# Altium schematic sheet mainPower.SchDoc
size A3; SheetNumber: 1; SheetTotal: 2
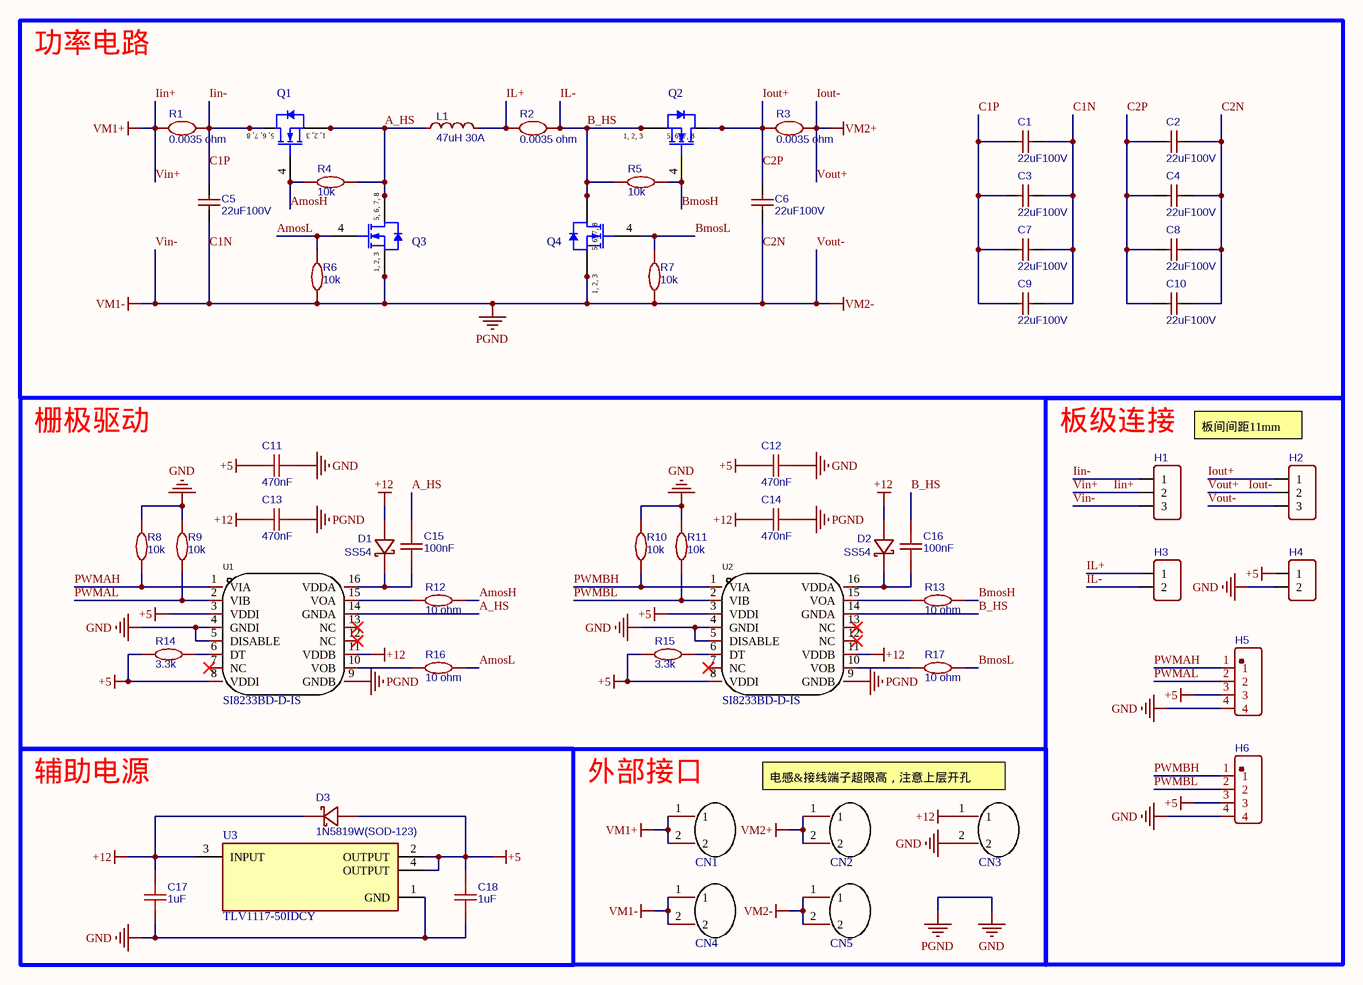
[diagram p0: mainPower.SchDoc]

## Parts
C1  22uF100V  [C1206]
C2  22uF100V  [C1206]
C3  22uF100V  [C1206]
C4  22uF100V  [C1206]
C5  22uF100V  [C1206]
C6  22uF100V  [C1206]
C7  22uF100V  [C1206]
C8  22uF100V  [C1206]
C9  22uF100V  [C1206]
C10  22uF100V  [C1206]
C11  470nF  [C0603]
C12  470nF  [C0603]
C13  470nF  [C0603]
C14  470nF  [C0603]
C15  100nF  [C0603]
C16  100nF  [C0603]
C17  1uF  [C0603]
C18  1uF  [C0603]
CN1  1729128  [CONN-TH_2P-P5.08]  (value not drawn)
CN2  1729128  [CONN-TH_2P-P5.08]  (value not drawn)
CN3  1729128  [CONN-TH_2P-P5.08]  (value not drawn)
CN4  1729128  [CONN-TH_2P-P5.08]  (value not drawn)
CN5  1729128  [CONN-TH_2P-P5.08]  (value not drawn)
D1  SS54  [SMA]
D2  SS54  [SMA]
D3  1N5819W(SOD-123)  [SOD-123]
H1  Header-Male-2.54_1x3  [HDR2.54-LI-3P]  (value not drawn)
H2  Header-Male-2.54_1x3  [HDR2.54-LI-3P]  (value not drawn)
H3  Header-Male-2.54_1x2  [HDR2.54-LI-2P]  (value not drawn)
H4  Header-Male-2.54_1x2  [HDR2.54-LI-2P]  (value not drawn)
H5  Header-Male-2.54_1x4  [HDR2.54-LI-4P]  (value not drawn)
H6  Header-Male-2.54_1x4  [HDR2.54-LI-4P]  (value not drawn)
L1  47uH 30A  [106-125立式]
Q1  BSC070N10NS3 G  [INF-PG-TDSON-8-1_V]  (value not drawn)
Q2  BSC070N10NS3 G  [INF-PG-TDSON-8-1_V]  (value not drawn)
Q3  BSC070N10NS3 G  [INF-PG-TDSON-8-1_V]  (value not drawn)
Q4  BSC070N10NS3 G  [INF-PG-TDSON-8-1_V]  (value not drawn)
R1  0.0035 ohm  [R2512]
R2  0.0035 ohm  [R2512]
R3  0.0035 ohm  [R2512]
R4  10k  [R0603]
R5  10k  [R0603]
R6  10k  [R0603]
R7  10k  [R0603]
R8  10k  [R0603]
R9  10k  [R0603]
R10  10k  [R0603]
R11  10k  [R0603]
R12  10 ohm  [R0603]
R13  10 ohm  [R0603]
R14  3.3k  [R0603]
R15  3.3k  [R0603]
R16  10 ohm  [R0603]
R17  10 ohm  [R0603]
U1  SI8233BD-D-IS  [SOIC-16_L10.3-W7.5-P1.27-LS10.3-BL]
U2  SI8233BD-D-IS  [SOIC-16_L10.3-W7.5-P1.27-LS10.3-BL]
U3  TLV1117-50IDCY  [FP-DCY0004A-MFG]

## Blocks framed on the sheet
功率电路: C1-C10 L1 Q1-Q4 R1-R7
栅极驱动: C11-C16 D1 D2 R8-R17 U1 U2
板级连接: H1-H6
辅助电源: C17 C18 D3 U3
外部接口: CN1-CN5

## Nets
+5: C11.2 C12.2 C18.2 D3.1(A) H4.1 H5.3 H6.3 R14.1 R15.1 U1.3(VDDI) U1.8(VDDI) U2.3(VDDI) U2.8(VDDI) U3.2(OUTPUT) U3.4(OUTPUT)
+12: C13.2 C14.2 C17.2 CN3.1 D1.1(A) D2.1(A) D3.2(K) U1.11(VDDB) U2.11(VDDB) U3.3(INPUT)
C1N: C1.2 C2.2 C3.2 C4.2 C5.1 C6.1 C7.2 C8.2 C9.2 C10.2 C11.1 C12.1 C13.1 C14.1 C17.1 C18.1 CN3.2 CN4.1 CN4.2 CN5.1 CN5.2 H1.3 H2.3 H4.2 H5.4 H6.4 Q3.1(SOURCE) Q3.2(SOURCE) Q3.3(SOURCE) Q4.1(SOURCE) Q4.2(SOURCE) Q4.3(SOURCE) R6.1 R7.1 R8.2 R9.2 R10.2 R11.2 U1.4(GNDI) U1.5(DISABLE) U1.9(GNDB) U2.4(GNDI) U2.5(DISABLE) U2.9(GNDB) U3.1(GND)  [also labelled C2N, GND, PGND, Vin-, VM1-, VM2-, Vout-]
Iin+: CN1.1 CN1.2 H1.2 R1.1  [also labelled Vin+, VM1+]
Iout-: CN2.1 CN2.2 H2.2 R3.2  [also labelled VM2+, Vout+]
A_HS: C15.2 L1.1 Q1.1(SOURCE) Q1.2(SOURCE) Q1.3(SOURCE) Q3.5(DRAIN) Q3.6(DRAIN) Q3.7(DRAIN) Q3.8(DRAIN) R4.1 U1.14(GNDA)
AmosH: Q1.4(GATE) R4.2 R12.2
AmosL: Q3.4(GATE) R6.2 R16.2
B_HS: C16.2 H3.2 Q2.1(SOURCE) Q2.2(SOURCE) Q2.3(SOURCE) Q4.5(DRAIN) Q4.6(DRAIN) Q4.7(DRAIN) Q4.8(DRAIN) R2.2 R5.2 U2.14(GNDA)  [also labelled IL-]
BmosH: Q2.4(GATE) R5.1 R13.2
BmosL: Q4.4(GATE) R7.2 R17.2
C1P: C1.1 C3.1 C5.2 C7.1 C9.1 H1.1 Q1.5(DRAIN) Q1.6(DRAIN) Q1.7(DRAIN) Q1.8(DRAIN) R1.2  [also labelled Iin-]
C2P: C2.1 C4.1 C6.2 C8.1 C10.1 H2.1 Q2.5(DRAIN) Q2.6(DRAIN) Q2.7(DRAIN) Q2.8(DRAIN) R3.1  [also labelled Iout+]
IL+: H3.1 L1.2 R2.1
PWMAH: H5.1 R8.1 U1.1(VIA)
PWMAL: H5.2 R9.1 U1.2(VIB)
PWMBH: H6.1 R10.1 U2.1(VIA)
PWMBL: H6.2 R11.1 U2.2(VIB)
NetC15_1: C15.1 D1.2(K) U1.16(VDDA)
NetC16_1: C16.1 D2.2(K) U2.16(VDDA)
NetR12_1: R12.1 U1.15(VOA)
NetR13_1: R13.1 U2.15(VOA)
NetR14_2: R14.2 U1.6(DT)
NetR15_2: R15.2 U2.6(DT)
NetR16_1: R16.1 U1.10(VOB)
NetR17_1: R17.1 U2.10(VOB)

Not connected (* = marked no-connect by the designer): U1 7(NC)* 12(NC)* 13(NC)*; U2 7(NC)* 12(NC)* 13(NC)*

## Notes on the sheet
- 板间间距11mm
- 电感&接线端子超限高，注意上层开孔
- (in symbol BSC070N10NS3G) 5, 6, 7, 8; 1, 2, 3

## Library data of the parts
C1-C10 = C1206: BOM_Manufacturer: FH; BOM_Manufacturer Part: 1206B102K202NT; nameAlias: Capacitance; BOM_Supplier: LCSC; BOM_Supplier Part: C9196; BOM_JLCPCB Part Class: Basic Part; spicePre: C; spiceSymbolName: 1206B102K202NT
C11-C18 = C0603: BOM_Manufacturer: YAGEO; BOM_Manufacturer Part: CC0603KRX7R9BB104; nameAlias: Capacitance; BOM_Supplier: LCSC; BOM_Supplier Part: C14663; BOM_JLCPCB Part Class: Basic Part; spicePre: C; spiceSymbolName: CC0603KRX7R9BB104
CN1-CN5 = MKDSN5.08-2P: 间距:5.08mm;排数:1;每排PIN数:2;安装方式:直针;额定电流:13.5A;额定电压:400V;工作温度范围:-;颜色:绿色;; Manufacturer: Phoenix Contact(菲尼克斯); Symbol: MKDSN1.5/2-5.08; Add into BOM: yes; Pitch: 5.08mm; Number of PINs Per Row: 2; Current Rating (Max): 13.5A; Voltage Rating (Max): 400V; Device: 1729128; LCSC Part Name: 5.08mm 排数:1 每排P数:2 直针; Supplier Part: C91153; Manufacturer Part: 1729128; Supplier Footprint: 插件,P=5.08mm; JLCPCB Part Class: Extended Part; Datasheet: https://atta.szlcsc.com/upload/public/pdf/source/20161226/1482720163948.pdf; Supplier: LCSC; Convert to PCB: yes; Number of Rows: 1; Mounting Style: 直针; Operating Temperature Range: -; Color: 绿色
D1 D2 = SS34(SMA): BOM_Manufacturer: Doeshare(德芯); BOM_Manufacturer Part: SS34; Contributor: LCSC; BOM_Supplier: LCSC; BOM_Supplier Part: C2931787; BOM_JLCPCB Part Class: Extended Part; spicePre: D; spiceSymbolName: SS34_C2931787
D3 = 1N5819W(SOD-123): BOM_Manufacturer: Doeshare(德芯); BOM_Manufacturer Part: SS34; Contributor: LCSC; BOM_Supplier: LCSC; BOM_Supplier Part: C2931787; BOM_JLCPCB Part Class: Extended Part; spicePre: D; spiceSymbolName: SS34_C2931787
H1 H2 = Header-Male-2.54_1x3: BOM_Manufacturer: BOOMELE; BOM_Manufacturer Part: Header2.54mm 1*3P; BOM_Supplier: LCSC; BOM_Supplier Part: C49257; BOM_JLCPCB Part Class: Extended Part; spicePre: H; spiceSymbolName: Header-Male-2.54_1x3
H3 H4 = Header-Male-2.54_1x2: BOM_Manufacturer: BOOMELE; BOM_Manufacturer Part: Header2.54mm 1*3P; BOM_Supplier: LCSC; BOM_Supplier Part: C49257; BOM_JLCPCB Part Class: Extended Part; spicePre: H; spiceSymbolName: Header-Male-2.54_1x3
H5 H6 = Header-Male-2.54_1x4: BOM_Manufacturer: Boom Precision Elec; BOM_Manufacturer Part: C247921; Contributor: LCSC; BOM_Supplier: LCSC; BOM_Supplier Part: C247921; BOM_JLCPCB Part Class: Extended Part; spicePre: H; spiceSymbolName: C247921
L1 = 106-125铁硅铝磁环电感: BOM_Manufacturer: FH(风华); BOM_Manufacturer Part: HA42-4R7MT; nameAlias: Inductance; Contributor: LCSC; BOM_Supplier: LCSC; BOM_Supplier Part: C2936653; BOM_JLCPCB Part Class: Extended Part; spicePre: L; spiceSymbolName: HA42-4R7MT
Q1-Q4 = BSC070N10NS3G: N-Channel OptiMOS 3 Power-Transistor, 100 V VDS, 90 A ID, -55 to 150 degC, PG-TDSON-8-1, Reel, Green; Manufacturer: Infineon; QG: 42Â nC; VGS(th) (min): 2Â V; RDS (on) (max): 7Â mOhm; ID (max): 90Â A; Polarity: N; RthJC (max): 1.1Â K/W; RthJA (max): 50Â K/W; VDS (max): 100Â V; Ptot (max): 114Â W; VGS(th) (max): 3.5Â V; IDpuls (max): 360Â A; Green: TRUE; ComponentLink2Description: Datasheet; DatasheetVersion: Rev. 2.0; Mounting Technology: Surface Mount; ComponentLink1Description: Manufacturer URL; ComponentLink3Description: Package Specification; ComponentLink1URL: http://www.infineon.com/; PackageDescription: 8-Pin Plastic (Green) Thin Dual Small Outline Non-Leaded Package, 5.15 x 5.9 mm Body, 1.27 mm Pitch; Packing: Reel; ComponentLink3URL: http://www.infineon.com/cms/packages/SMD_-_Surface_Mounted_Devices/P-PG-TDSON/P-PG-TDSON-08-01x_2x_3.html?__locale=en; PackageReference: PG-TDSON-8-1; PartNumber: BSC070N10NS3 G; Halogen-free: TRUE; Rth: 1.1Â K/W; ComponentLink2URL: http://www.infineon.com/dgdl/BSC070N10NS3+Rev2+1.pdf?folderId=db3a304313b8b5a60113cee8763b02d7&fileId=db3a304327b89750012824712c6c6f2f; Manufacturer Part Number: BSC070N10NS3G
R1-R3 = R2512: BOM_Manufacturer: YAGEO; BOM_Manufacturer Part: SR2512FK-0751RL; nameAlias: Resistance (Ohms); Contributor: LCSC; Resistance: 51Ω; BOM_Supplier: LCSC; BOM_Supplier Part: C375694; BOM_JLCPCB Part Class: Extended Part; spicePre: R; spiceSymbolName: SR2512FK-0751RL
R4-R17 = R0603: BOM_Manufacturer: YAGEO; BOM_Manufacturer Part: SR0603JR-071RL; nameAlias: Resistance (Ohms); Contributor: LCSC; Resistance: 1Ω; BOM_Supplier: LCSC; BOM_Supplier Part: C326890; BOM_JLCPCB Part Class: Extended Part; spicePre: R; spiceSymbolName: SR0603JR-071RL
U1 U2 = SI8233BD-D-IS: 高速隔离半桥栅极驱动器; Manufacturer: SILICON LABS(芯科); Add into BOM: yes; Name: SI8233BD-D-IS; Symbol: SI8233BD-D-IS; Device: SI8233BD-D-IS; LCSC Part Name: SI8233BD-D-IS; Supplier Part: C430246; Manufacturer Part: SI8233BD-D-IS; Supplier Footprint: SOIC-16_W; JLCPCB Part Class: Extended Part; Datasheet: https://atta.szlcsc.com/upload/public/pdf/source/20190920/C430246_81ACDC97509C517087989819A83AC3BD.pdf; Supplier: LCSC; Convert to PCB: yes
U3 = CMP-04917-000165-1: IC REG LINEAR 5V 800MA SOT223-4; Dropout Voltage: 1.2V; Input Bias Current: 5mA; Output Type: Fixed; Quiescent Current: 15mA; Number of Regulators: 1; Min Input Voltage: 6.4V; Polarity: Positive; Max Input Voltage: 15V; Reference Voltage: 5.2V; Case/Package: SOT-223; Series: -; Radiation Hardening: No; Width: 3.7mm; Lead Free: Lead Free; Min Operating Temperature: -40°C; Mount: Surface Mount; Packaging: Rail/Tube; Min Current Limit: 800mA; Max Output Current: 800mA; Height: 1.7mm; Output Current: 800mA; Number of Outputs: 1; REACH SVHC: No SVHC; Nominal Output Voltage: 5V; Length: 6.7mm; Max Operating Temperature: 125°C; Output Voltage: 5V; Number of Pins: 3; Package Quantity: 80; RoHS Compliant: Yes